# Altium schematic sheet POWER.SchDoc
size A3; SheetNumber: 2; SheetTotal: 2
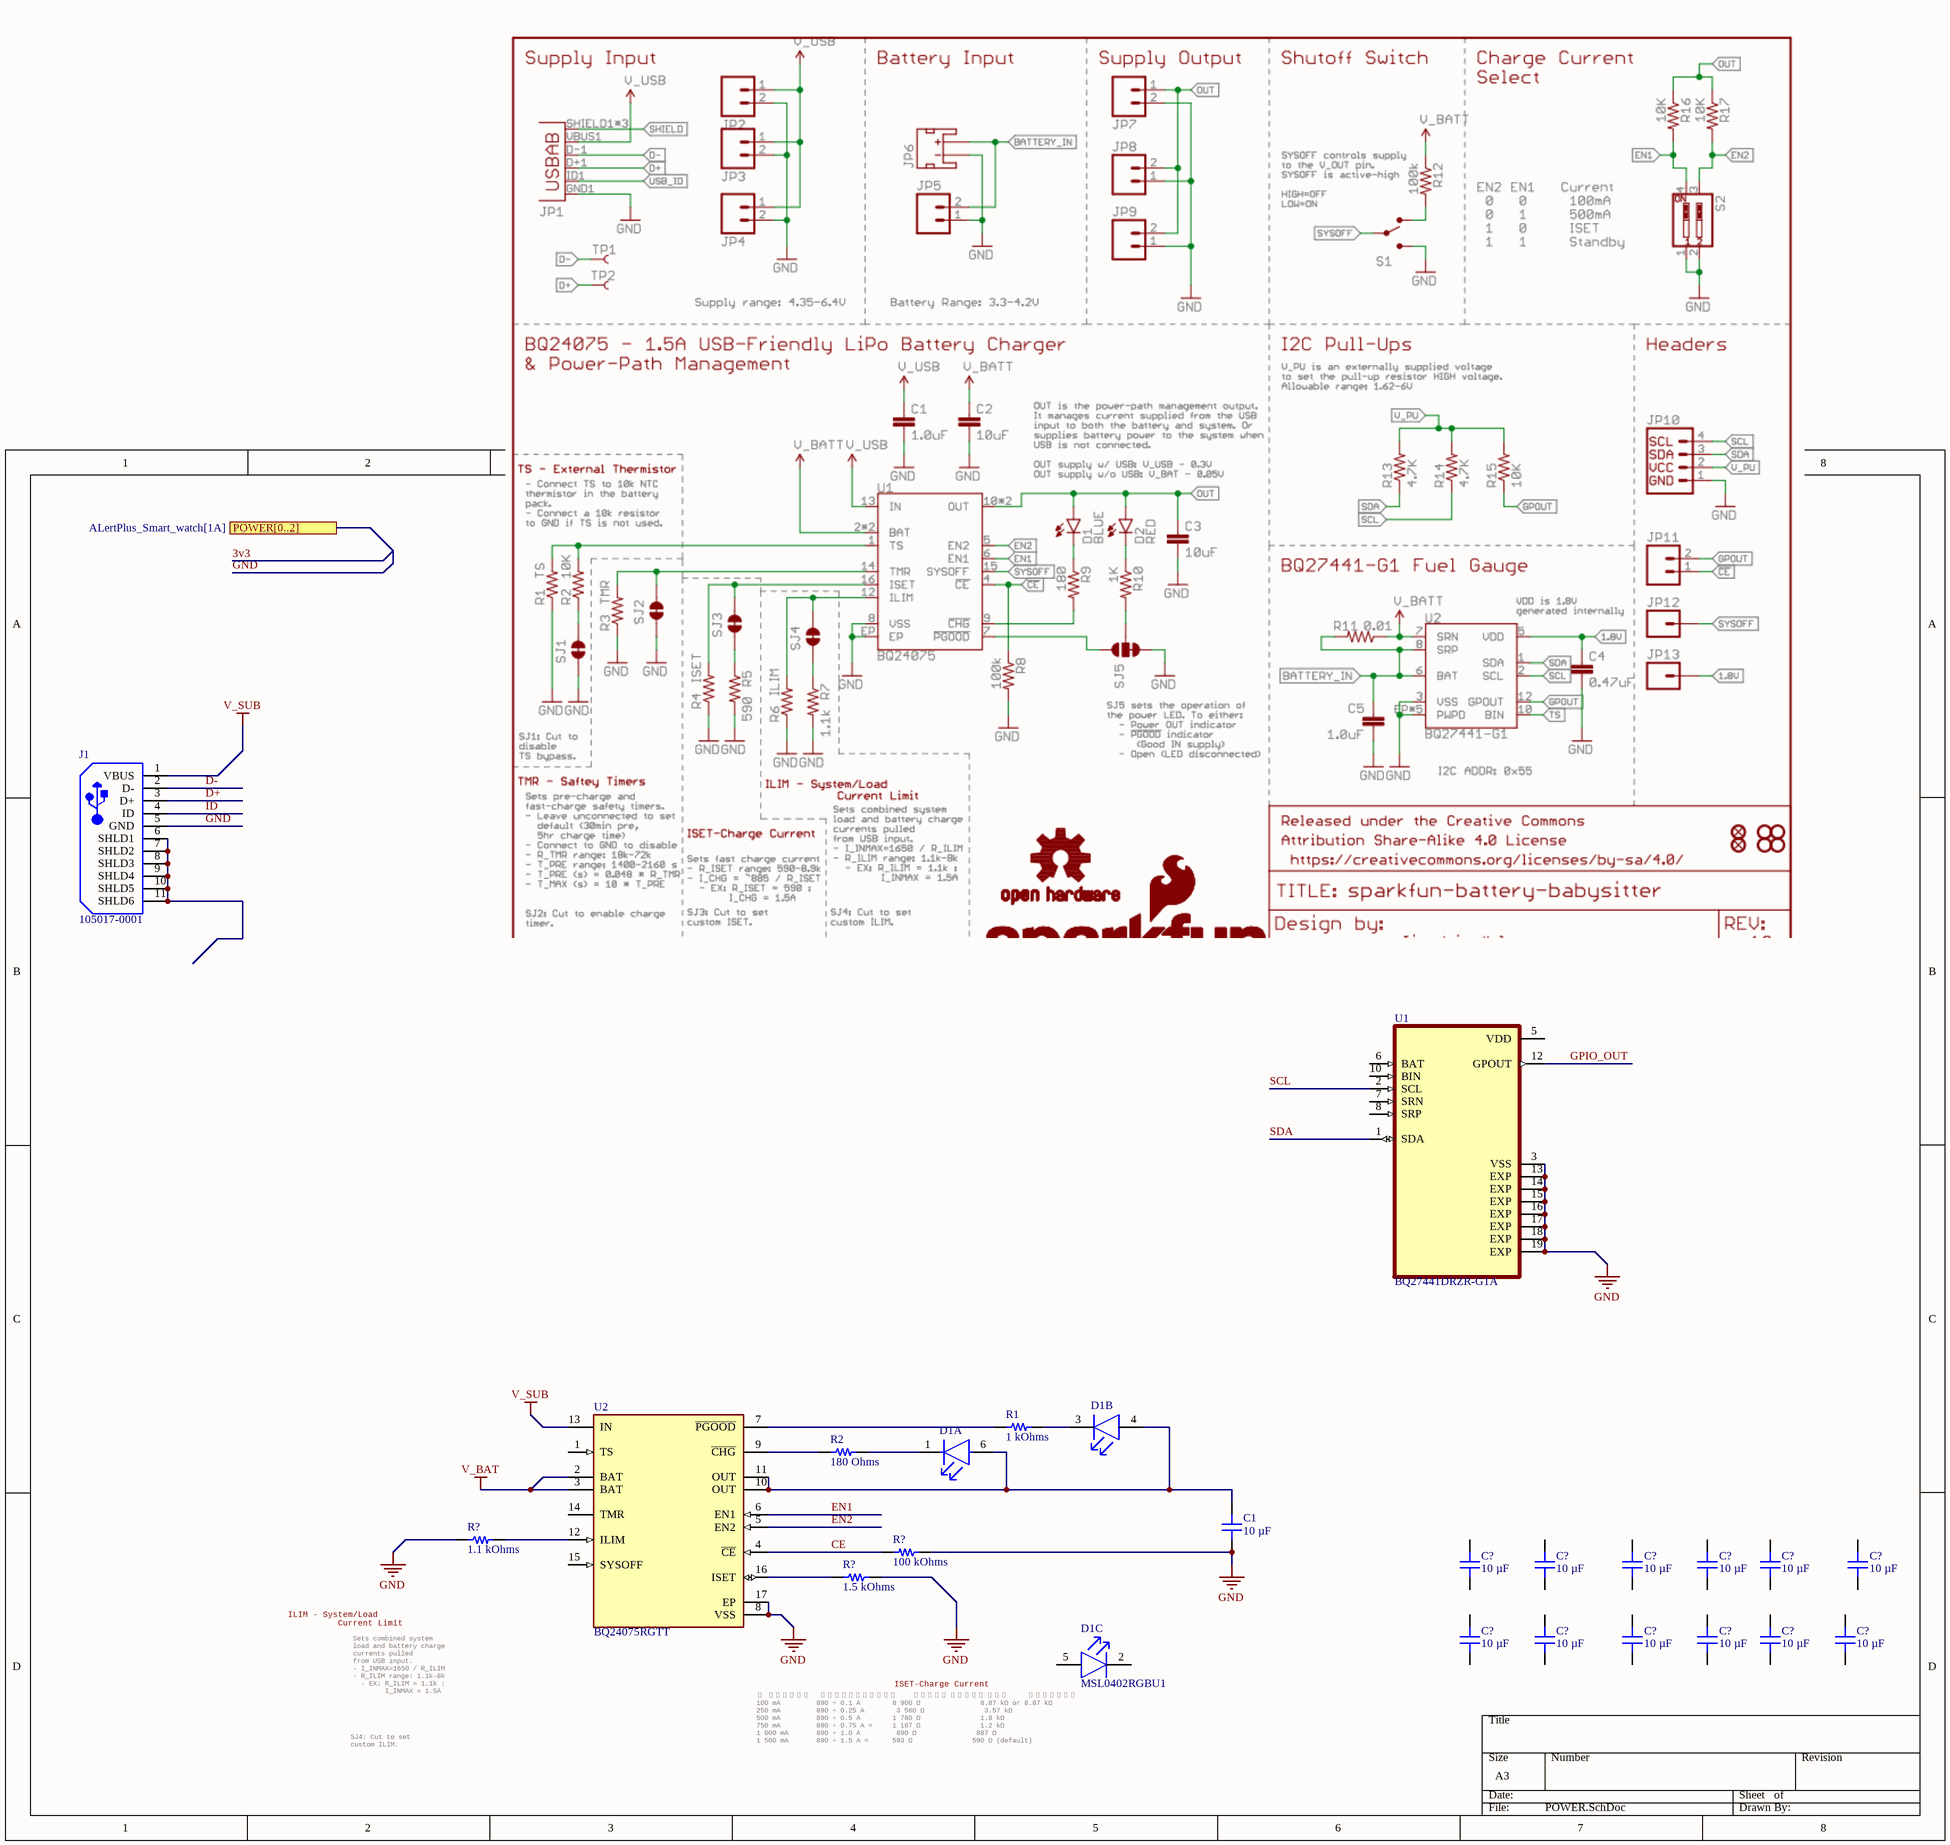
[diagram p0: POWER.SchDoc]

## Parts
(Parts that share a designator on the sheet are numbered #1, #2 ... from top to bottom, then left to right.)
C1  10 µF  [CAP 0402_1005]
C?#1  10 µF  [CAP 0402_1005]
C?#2  10 µF  [CAP 0402_1005]
C?#3  10 µF  [CAP 0402_1005]
C?#4  10 µF  [CAP 0402_1005]
C?#5  10 µF  [CAP 0402_1005]
C?#6  10 µF  [CAP 0402_1005]
C?#7  10 µF  [CAP 0402_1005]
C?#8  10 µF  [CAP 0402_1005]
C?#9  10 µF  [CAP 0402_1005]
C?#10  10 µF  [CAP 0402_1005]
C?#11  10 µF  [CAP 0402_1005]
C?#12  10 µF  [CAP 0402_1005]
D1  MSL0402RGBU1  [FP-MSL0402-MFG]  (value not drawn)  (parts A,B,C of 3)
J1  105017-0001  [USB-MICRO-B_V]
R1  1 kOhms  [RES 0402_1005]
R2  180 Ohms  [YAGEO RES 0402_1005]
R?#1  1.1 kOhms  [YAGEO RES 0402_1005]
R?#2  100 kOhms  [RES 0402_1005]
R?#3  1.5 kOhms  [RES 0402_1005]
U1  BQ27441DRZR-G1A  [IC_BQ27441DRZR-G1A]
U2  BQ24075RGTT  [FP-RGT0016C-IPC_C]

## Ports
POWER[0..2] (see ALertPlus_Smart_watch[1A])

## Nets
GND: C1.1 J1.5(GND) R?#1.1 R?#2.1 R?#3.2 U1.3(VSS) U1.13(EXP) U1.14(EXP) U1.15(EXP) U1.16(EXP) U1.17(EXP) U1.18(EXP) U1.19(EXP) U2.8(VSS) U2.17(EP)
V_BAT: U2.2(BAT) U2.3(BAT)
V_SUB: J1.1(VBUS) U2.13(IN)
CE: R?#2.2 U2.4(~{CE})
D+: J1.3(D+)
D-: J1.2(D-)
EN1: U2.6(EN1)
EN2: U2.5(EN2)
GPIO_OUT: U1.12(GPOUT)
ID: J1.4(ID)
SCL: U1.2(SCL)
SDA: U1.1(SDA)
NetC1_2: C1.2 D1.4(RED_A) D1.6(BLUE_A) U2.10(OUT) U2.11(OUT)
NetD1_1: D1.1(BLUE_C) R2.1
NetD1_3: D1.3(RED_C) R1.2
NetJ1_6: J1.6(SHLD1) J1.7(SHLD2) J1.8(SHLD3) J1.9(SHLD4) J1.10(SHLD5) J1.11(SHLD6)
NetR1_1: R1.1 U2.7(~{PGOOD})
NetR2_2: R2.2 U2.9(~{CHG})
NetR?#1_2: R?#1.2 U2.12(ILIM)
NetR?#3_1: R?#3.1 U2.16(ISET)

Not connected (* = marked no-connect by the designer): C?#1 1 2; C?#2 1 2; C?#3 1 2; C?#4 1 2; C?#5 1 2; C?#6 1 2; C?#7 1 2; C?#8 1 2; C?#9 1 2; C?#10 1 2; C?#11 1 2; C?#12 1 2; D1 2(GREEN_C) 5(GREEN_A); U1 5(VDD) 6(BAT) 7(SRN) 8(SRP) 10(BIN); U2 1(TS) 14(TMR) 15(SYSOFF)

## Notes on the sheet
- ILIM - System/Load
  Current Limit
- ISET-Charge Current
- Sets combined system
  load and battery charge
  currents pulled
  from USB input.
  - I_INMAX=1650 / R_ILIM
  - R_ILIM range: 1.1k-8k
  - EX: R_ILIM = 1.1k :
  I_INMAX = 1.5A
- SJ4: Cut to set
  custom ILIM.
- (near D1) I  CHARGE     Calculation	       𝑅𝐼𝑆𝐸𝑇 RISET (Ω)          R_Value
  100 mA	        890 ÷ 0.1 A	       8 900 Ω	              8.87 kΩ or 8.87 kΩ
  250 mA	        890 ÷ 0.25 A	       3 560 Ω	              3.57 kΩ
  500 mA	        890 ÷ 0.5 A	       1 780 Ω	              1.8 kΩ
  750 mA	        890 ÷ 0.75 A	≈     1 187 Ω	              1.2 kΩ
  1 000 mA       890 ÷ 1.0 A	        890 Ω	              887 Ω
  1 500 mA       890 ÷ 1.5 A	≈      593 Ω	              590 Ω (default)

## Library data of the parts
C1 C?#1-C?#12 = CL05A106MP8NUB8: CAP CER 10UF 10V X5R 0402; Part Number: CL05A106MP8NUB8; Capacitance: 10 µF
D1 = CMP-08952-000010-1: LED RGB DIFFUSED 1816 SMD; Manufacturer: Rohm; Wavelength: 470/527/624nm; Luminous Intensity: 180/550/400mcd; Forward Voltage: 3.3/3.5/2.1V; Power Dissipation: 180mW; Colour: Blue, Green, Red; Reverse Voltage: 5V; Forward Current: 20mA; Description: Red, Green, Blue (RGB) 624nm Red, 527nm Green, 470nm Blue LED Indication - Discrete 2.1V Red, 3.5V Green, 3.3V Blue 6-SMD, No Lead; Led Orientation: Top View; Lead Free: Yes; Manufacturer Part Number: MSL0402RGBU1; Octopart: https://octopart.com/msl0402rgbu1-rohm-74168054; Device Class L2: LEDs; Digikey Description: LED RGB DIFFUSED 1816 SMD; Package: MSL0402; Temperature Range High: +85°C; RoHS: TRUE; Temperature: -40°C to +85°C; Category: Diode; Height: 0.6mm; Temperature Range Low: -40°C; Device Class L1: Optoelectronics; ComponentLink2Description: Datasheet; Automotive: No; ComponentLink2URL: https://d1d2qsbl8m0m72.cloudfront.net/en/products/databook/datasheet/opto/led/chip_multi/msl0402rgb-e.pdf; Device Class L3: unset
J1 = CMP-2000-05827-1: Micro-USB B Receptacle, Right Angle, Bottom Mount, Surface Mount, with Solder Tabs, -30 to 85 degC, 5-Pin USB, RoHS, Tape and Reel; Manufacturer: Molex; Featured Product: Micro-USBConnectorsUSBConnectors; Other Names: WM1399DKR; Package Version: Rev. F, 12/2012; Number of Contacts: 5; Connector Type: USB-microB; Catalog Drawings: 1050170001; 3D Model: 105017-0001.stp; Mating Products: WM17145-ND-CABLEMICROUSBBTOSTDA1.0MWM17147-ND-CABLEMICROUSBBTOSTDA2.0MWM17146-ND-CABLEMICROUSBBTOSTDA1.5M; PCN Assembly/Origin: ResinSupplier21/Oct/2015; Voltage - Max: 30V; Online Catalog: Molex-MicroUSB; Manufacturer URL: http://www.molex.com/; Package Description: 5-Leads USB, Micro B, Body 7.5 x 5 mm, Pitch 0.65 mm; Datasheet URL: http://www.molex.com/elqNow/elqRedir.htm?ref=http://www.molex.com/webdocs/datasheets/pdf/en-us/1050170001_IO_CONNECTORS.pdf; Ingress Protection: -; Datasheet Version: 03/2016; Mounting Type: BoardCutout,SurfaceMount,RightAngle; Circuits: 5; Standard Package: 1; Package Reference: MICRO-B; Package URL: http://www.molex.com/pdm_docs/sd/1050170001_sd.pdf; Category: Connectors,Interconnects; Series: -; RoHS Information: 1050170001CertofCompliance; Features: Shielded,SolderRetention; Family: USB,DVI,HDMIConnectors; Specifications: -; Gender: Receptacle; Packaging: Digi-Reel®; Mounting Technology: SurfaceMount
R1 = RQ73C1E1K0BTD: RES 1 KOHMS 0.1% 1/16W 0402; Part Number: RQ73C1E1K0BTD; Value: 1 kOhms
R2 = RT0402BRD07180RL: RES SMD 180 OHM 0.1% 1/16W 0402; Part Number: RT0402BRD07180RL; Value: 180 Ohms
R?#1 = RC0402FR-071K1L: RES 1.1K OHM 1% 1/16W 0402; Part Number: RC0402FR-071K1L; Value: 1.1 kOhms
R?#2 = RP73PF1E100KBTD: RES 100K OHM 0.1% 1/10W 0402; Part Number: RP73PF1E100KBTD; Value: 100 kOhms
R?#3 = RR0510P-152-D: RES SMD 1.5K OHM 0.5% 1/16W 0402; Part Number: RR0510P-152-D; Value: 1.5 kOhms
U1 = BQ27441DRZR-G1A: System-side Impedance Trackâ„¢ battery fuel (gas) gauge; MF: Texas Instruments; SnapEDA_Link: https://www.snapeda.com/parts/BQ27441DRZR-G1A/Texas+Instruments/view-part/?ref=snap; Package: VSON-12 Texas Instruments; Value: *; MP: BQ27441DRZR-G1A; Check_prices: https://www.snapeda.com/parts/BQ27441DRZR-G1A/Texas+Instruments/view-part/?ref=eda
U2 = CMP-0321-00236-3: IC LI-ION CHARGE/PWR MGMT 16-QFN; Min Input Voltage: 4.3V; Output Voltage: 4.2V; Max Input Voltage: 26V; Min Supply Voltage: 4.35V; Max Supply Voltage: 6.4V; Min Output Voltage: 5.4V; Output Current: 1.5A; Number of Cells: 1; Max Output Current: 4.5A; Max Output Voltage: 5.6V; Battery Type: LITHIUM-ION; Package Quantity: 1; Length: 3.15mm; Weight: 0.000808oz; Termination: SMD/SMT; Height: 0.95mm; Series: -; Lead Free: Lead Free; Radiation Hardening: No; REACH SVHC: No SVHC; Case/Package: QFN; Number of Pins: 16; Width: 3.15mm; Max Operating Temperature: 85°C; Contact Plating: Gold; Max Charge Current: 1.5A; Packaging: Tape and Reel; Min Operating Temperature: -40°C